# EAGLE design HitBoxV0.31-Powaa (EAGLE 9.1.3)
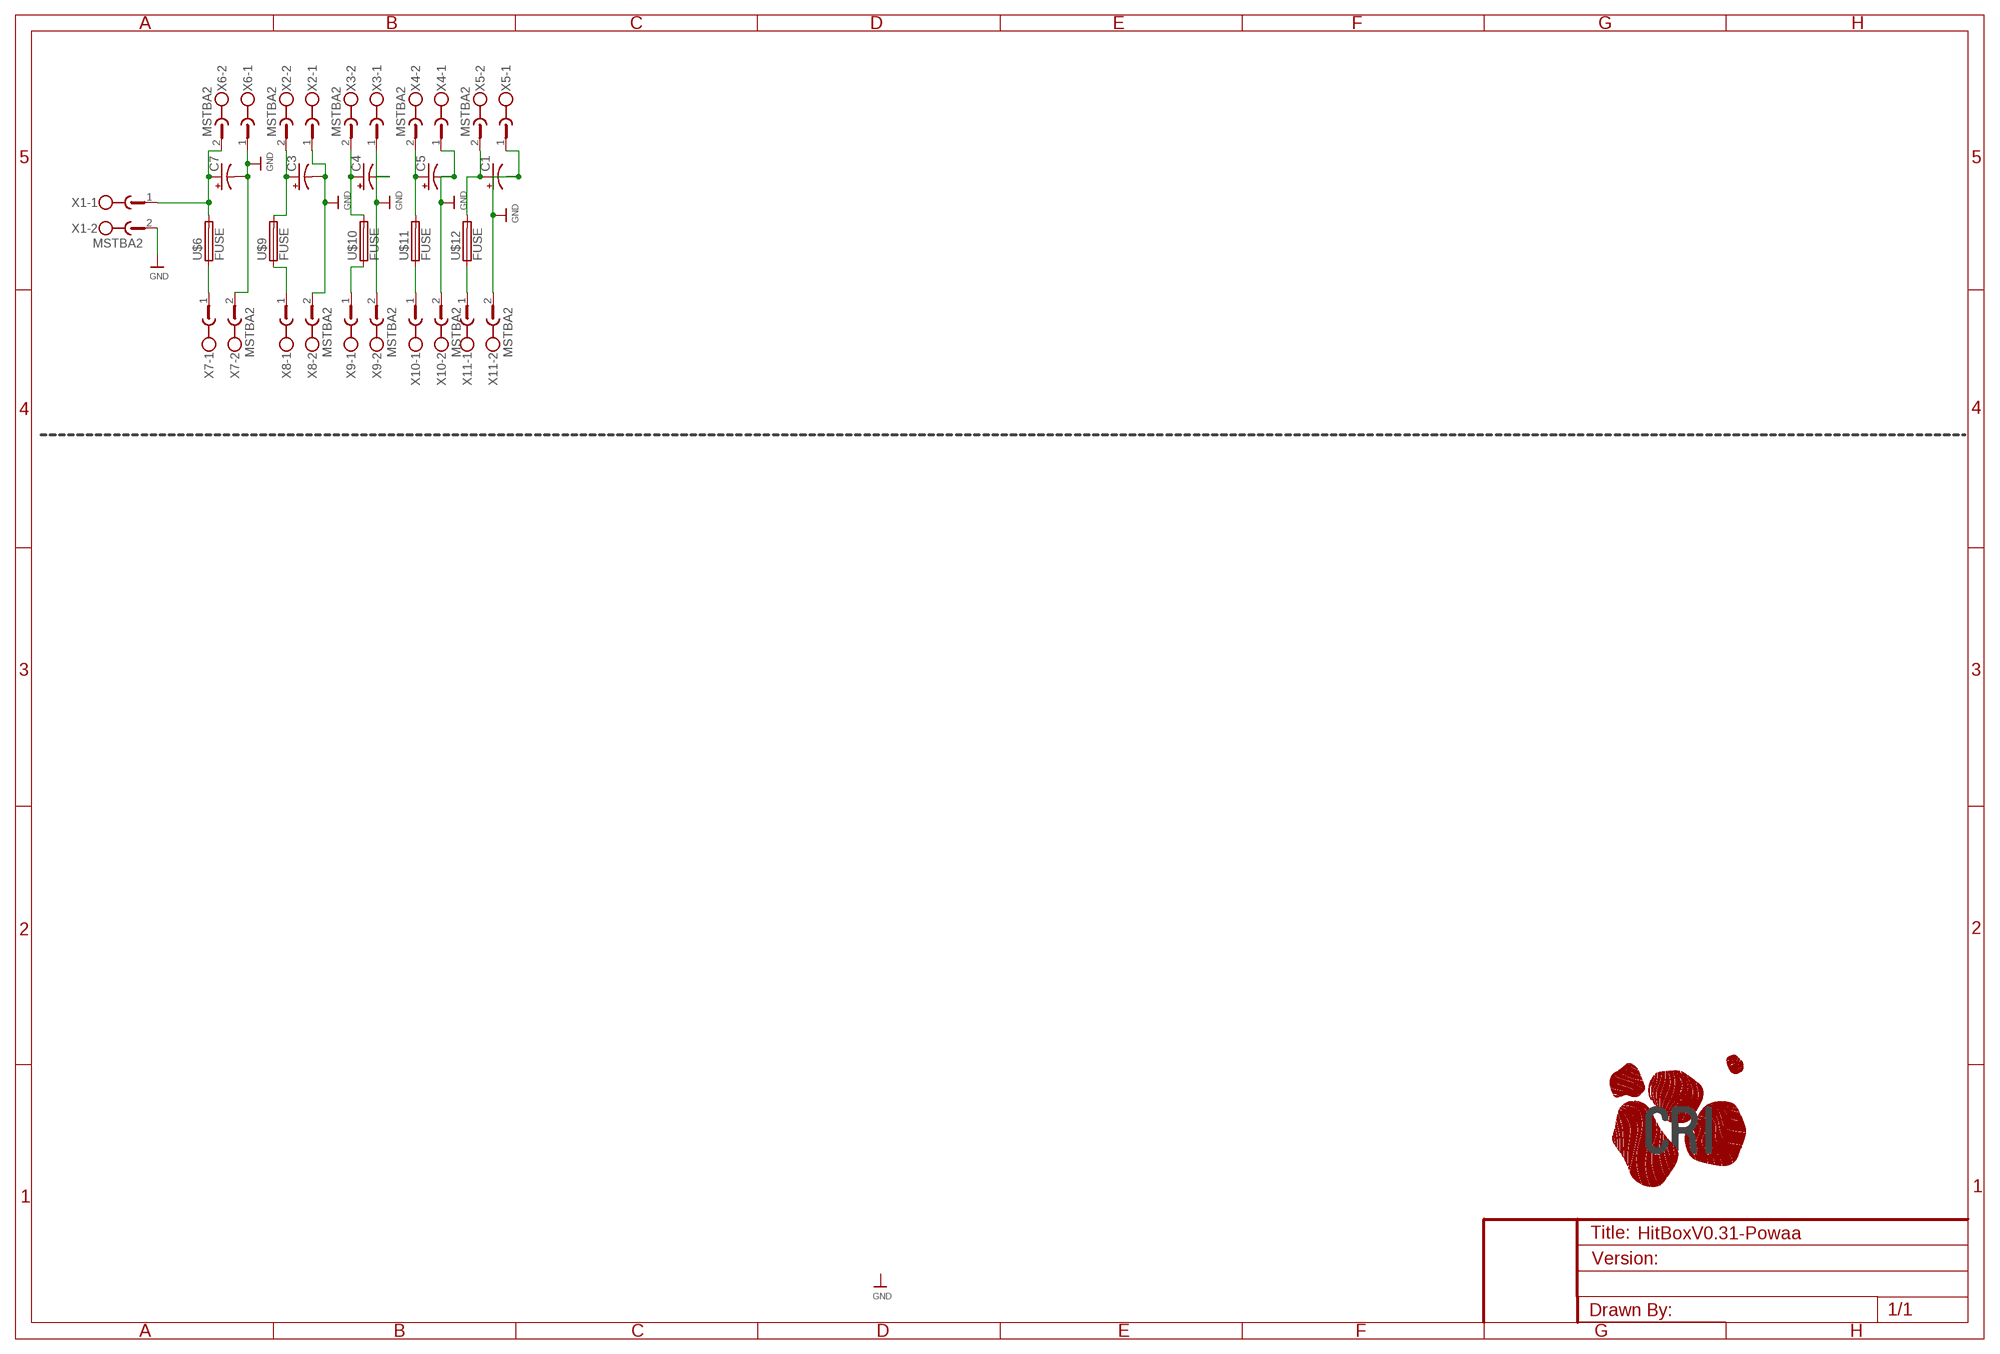
[diagram p0: schematic, sheet 1]

## Parts
C1  CPOL-USE2,5-6E  [E2,5-6E]
C3  CPOL-USE2,5-6E  [E2,5-6E]
C4  CPOL-USE2,5-6E  [E2,5-6E]
C5  CPOL-USE2,5-6E  [E2,5-6E]
C7  CPOL-USE2,5-6E  [E2,5-6E]
U$6  FUSE  [KEYSTONE-AUTO-FUSE]
U$7  LOGO-CRI-NEW-130MMX30MM-TPLACE  [LOGO_CRI-NEW-BMP30MM-TOP]
U$9  FUSE  [KEYSTONE-AUTO-FUSE]
U$10  FUSE  [KEYSTONE-AUTO-FUSE]
U$11  FUSE  [KEYSTONE-AUTO-FUSE]
U$12  FUSE  [KEYSTONE-AUTO-FUSE]
X1  MSTBA2  [MSTBA2]
X2  MSTBA2  [MSTBA2]
X3  MSTBA2  [MSTBA2]
X4  MSTBA2  [MSTBA2]
X5  MSTBA2  [MSTBA2]
X6  MSTBA2  [MSTBA2]
X7  MSTBA2  [MSTBA2]
X8  MSTBA2  [MSTBA2]
X9  MSTBA2  [MSTBA2]
X10  MSTBA2  [MSTBA2]
X11  MSTBA2  [MSTBA2]

## Nets
GND: C1.- C3.- C4.- C5.- C7.- X1.2 X2.1 X3.1 X4.1 X5.1 X6.1 X7.2 X8.2 X9.2 X10.2 X11.2
N$2: C7.+ U$6.P$3 U$6.P$4 X1.1 X6.2
N$3: C3.+ U$9.P$3 U$9.P$4 X2.2
N$6: C4.+ U$10.P$3 U$10.P$4 X3.2
N$8: C5.+ U$11.P$3 U$11.P$4 X4.2
N$10: C1.+ U$12.P$3 U$12.P$4 X5.2
N$106: U$6.P$1 U$6.P$2 X7.1
N$107: U$9.P$1 U$9.P$2 X8.1
N$108: U$10.P$1 U$10.P$2 X9.1
N$109: U$11.P$1 U$11.P$2 X10.1
N$110: U$12.P$1 U$12.P$2 X11.1

## Library data of the parts
C1 C3-C5 C7 = adafruit:CPOL-US: POLARIZED CAPACITOR, American symbol
U$6 U$9-U$12 = movuinoV0:FUSE
U$7 = movuino_aestheticsV0:LOGO-CRI-NEW-1
X1-X11 = con-phoenix-508:MSTBA2: PHOENIX; MF: FARNELL; MPN: 1757242; OC_FARNELL: 3705171; OC_NEWARK: 71C4161

## Net classes
1 pcbway_smallest: width 0.102 mm, drill 0.2 mm, clearance 0.102 mm

## Board
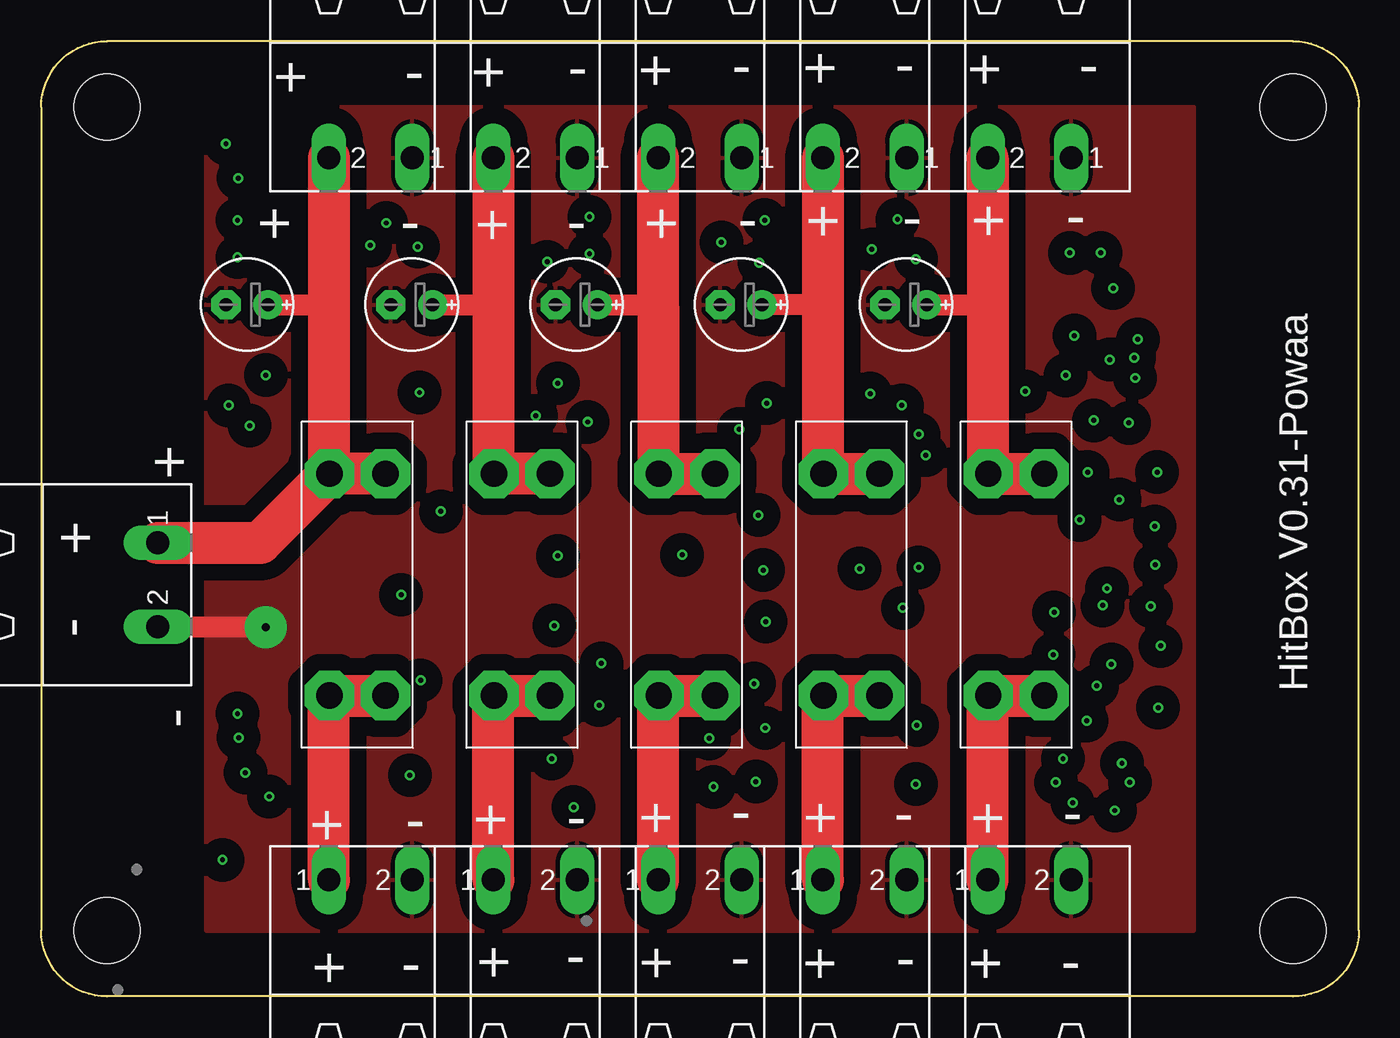
[diagram p1: board, top side]
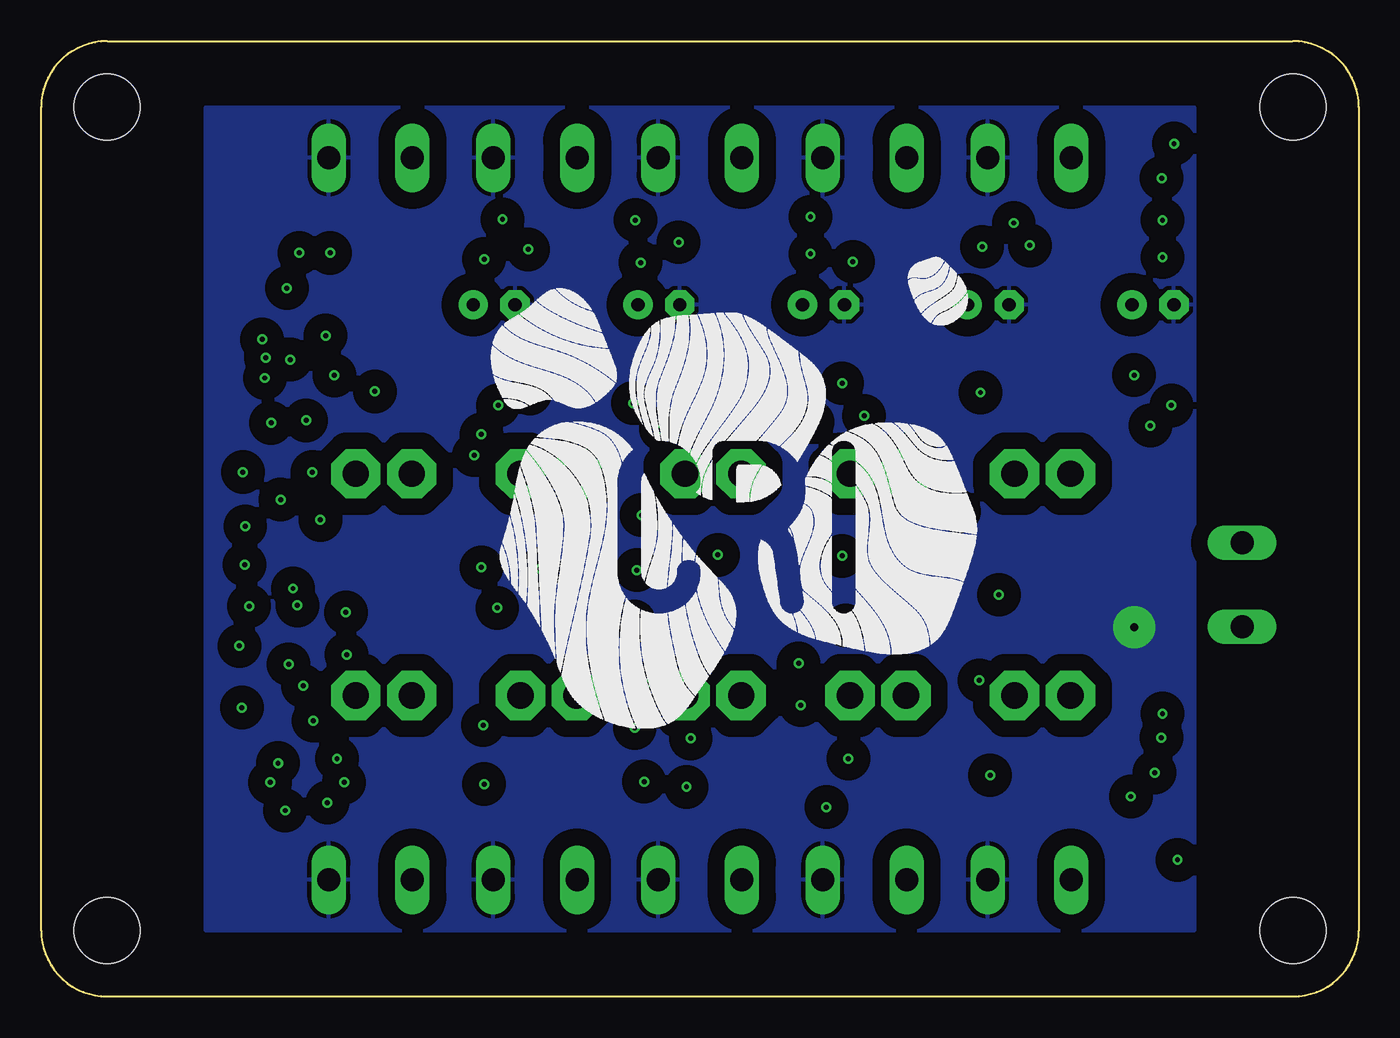
[diagram p2: board, bottom side, seen from below]

Size 80 x 58 mm. Coordinates in mm from the lower left corner, seen from the top.
Outline: 0,54 0,4 arc90 4,0 76,0 arc90 80,4 80,54 arc90 76,58 4,58 arc90 0,54
Copper layers (1*16): Top 0.035mm / dielectric 1.5mm / Bottom 0.035mm
Design rules "PCBWAY_2layer_DRU_no_angle_cheap": minimum track width 0.2mm, minimum drill 0.3mm, track to track 6mil, track to pad 6mil, pad to pad 6mil, via to via 6mil, smd to smd 0mil, copper to edge 10mil, drill to drill 10mil, minimum pad ring 10mil, minimum via ring 6mil, stop-mask expansion 2mil, vias tented up to drill 100mil, thermal gap 10mil
Holes 4 mm at 76,54 4,4 4,54 76,4

### Footprints (pad centres in the part's own frame; a part is rotated, then mirrored left to right if it is on the bottom)
E2,5-6E = drill 0.813 pad 1.778: + -1.27,0 | drill 0.813 pad 1.778 octagon: - 1.27,0
KEYSTONE-AUTO-FUSE = drill 1.6 pad 3 octagon: P$1 -6.735,1.7; P$2 -6.735,-1.7; P$3 6.735,1.7; P$4 6.735,-1.7
MSTBA2 = drill 1.397 long: 1 -2.54,5.08; 2 2.54,5.08

### Placement (x,y rotation side)
C1  52.5,42 180 top
C3  22.5,42 180 top
C4  32.5,42 180 top
C5  42.5,42 180 top
C7  12.5,42 180 top
U$6  19.2,25 90 top
U$7  36.56,28.76 0 bottom
U$9  29.2,25 90 top
U$10  39.2,25 90 top
U$11  49.2,25 90 top
U$12  59.2,25 90 top
X1  2,25 270 top
X2  30,56 180 top
X3  40,56 180 top
X4  50,56 180 top
X5  60,56 180 top
X6  20,56 180 top
X7  20,2 0 top
X8  30,2 0 top
X9  40,2 0 top
X10  50,2 0 top
X11  60,2 0 top

### Tracks (layer width: path | path; a pad name or v marks a point on that pad's centre or on a via)
GND  (via drill 0.5 pad 2.54)
  Top 1.27: X1.2 13.6,22.46 v13.64,22.42
  pour Bottom (isolate 1.016): 70,54 10,54 10,4 70,4
  pour Top (isolate 1.016): 70,54 10,54 10,4 70,4
N$2
  Top 1.27: C7.+ 16.96,42 17.46,41.5
  Top 2.54: X6.2 17.46,41.5 17.46,31.77 | 17.46,31.77 U$6.P$3 | U$6.P$4 U$6.P$3 | U$6.P$3 17.46,31.77 | X1.1 13.3,27.54 U$6.P$3
N$3
  Top 1.27: C3.+ 27.36,42 27.46,42.1
  Top 2.54: X2.2 27.46,42.1 27.46,31.77 | 27.46,31.77 U$9.P$3 | U$9.P$4 U$9.P$3 | U$9.P$3 27.46,31.77
N$4  (via drill 0.3 pad 0.6)
  other vias: 13.64,37.72
N$6
  Top 1.27: C4.+ 37.46,42 37.46,41.9
  Top 2.54: X3.2 37.46,41.9 37.46,31.77 U$10.P$3 U$10.P$4
N$7  (via drill 0.3 pad 0.6)
  other vias: 12.66,34.66
N$8
  Top 1.27: 47.46,42 C5.+
  Top 2.54: X4.2 47.46,42 47.46,31.77 U$11.P$3 U$11.P$4
N$10
  Top 1.27: C1.+ 57.26,42 57.46,42.2
  Top 2.54: X5.2 57.46,42.2 57.46,31.77 U$12.P$3 U$12.P$4
N$11  (via drill 0.3 pad 0.6)
  other vias: 11.38,35.89
N$17  (via drill 0.3 pad 0.6)
  other vias: 11.92,44.88
N$18  (via drill 0.3 pad 0.6)
  other vias: 11.92,47.13
N$19  (via drill 0.3 pad 0.6)
  other vias: 20.95,46.96
N$20  (via drill 0.3 pad 0.6)
  other vias: 22.87,45.52
N$21  (via drill 0.3 pad 0.6)
  other vias: 19.97,45.6
N$22  (via drill 0.3 pad 0.6)
  other vias: 22.97,36.67
N$23  (via drill 0.3 pad 0.6)
  other vias: 24.27,29.45
N$24  (via drill 0.3 pad 0.6)
  other vias: 21.85,24.39
N$25  (via drill 0.3 pad 0.6)
  other vias: 23.04,19.19
N$26  (via drill 0.3 pad 0.6)
  other vias: 22.39,13.43
N$27  (via drill 0.3 pad 0.6)
  other vias: 12.4,13.59
N$28  (via drill 0.3 pad 0.6)
  other vias: 11.92,17.17
N$29  (via drill 0.3 pad 0.6)
  other vias: 31.15,22.52
N$30  (via drill 0.3 pad 0.6)
  other vias: 33.87,17.68
N$31  (via drill 0.3 pad 0.6)
  other vias: 30.99,14.44
N$32  (via drill 0.3 pad 0.6)
  other vias: 32.33,11.5
N$33  (via drill 0.3 pad 0.6)
  other vias: 34.01,20.22
N$34  (via drill 0.3 pad 0.6)
  other vias: 31.37,26.75
N$35  (via drill 0.3 pad 0.6)
  other vias: 30.04,35.26
N$36  (via drill 0.3 pad 0.6)
  other vias: 33.18,34.88
N$37  (via drill 0.3 pad 0.6)
  other vias: 31.37,37.23
N$38  (via drill 0.3 pad 0.6)
  other vias: 30.72,44.61
N$39  (via drill 0.3 pad 0.6)
  other vias: 33.29,47.34
N$40  (via drill 0.3 pad 0.6)
  other vias: 33.29,45.09
N$41  (via drill 0.3 pad 0.6)
  other vias: 41.3,45.79
N$42  (via drill 0.3 pad 0.6)
  other vias: 43.92,47.13
N$43  (via drill 0.3 pad 0.6)
  other vias: 43.6,44.56
N$44  (via drill 0.3 pad 0.6)
  other vias: 42.37,34.45
N$45  (via drill 0.3 pad 0.6)
  other vias: 44.06,36.03
N$46  (via drill 0.3 pad 0.6)
  other vias: 43.55,29.23
N$47  (via drill 0.3 pad 0.6)
  other vias: 38.92,26.81
N$48  (via drill 0.3 pad 0.6)
  other vias: 43.83,25.88
N$49  (via drill 0.3 pad 0.6)
  other vias: 43.99,22.76
N$50  (via drill 0.3 pad 0.6)
  other vias: 43.28,18.99
N$51  (via drill 0.3 pad 0.6)
  other vias: 43.96,16.3
N$52  (via drill 0.3 pad 0.6)
  other vias: 40.56,15.67
N$53  (via drill 0.3 pad 0.6)
  other vias: 40.82,12.73
N$54  (via drill 0.3 pad 0.6)
  other vias: 43.39,13.05
N$55  (via drill 0.3 pad 0.6)
  other vias: 53.11,12.89
N$56  (via drill 0.3 pad 0.6)
  other vias: 53.17,16.48
N$57  (via drill 0.3 pad 0.6)
  other vias: 64.1,18.86
N$58  (via drill 0.3 pad 0.6)
  other vias: 52.31,23.59
N$59  (via drill 0.3 pad 0.6)
  other vias: 53.27,26.05
N$60  (via drill 0.3 pad 0.6)
  other vias: 49.69,25.98
N$61  (via drill 0.3 pad 0.6)
  other vias: 53.71,32.87
N$62  (via drill 0.3 pad 0.6)
  other vias: 53.27,34.13
N$63  (via drill 0.3 pad 0.6)
  other vias: 52.26,35.89
N$64  (via drill 0.3 pad 0.6)
  other vias: 50.44,45.36
N$65  (via drill 0.3 pad 0.6)
  other vias: 51.99,47.18
N$66  (via drill 0.3 pad 0.6)
  other vias: 53.11,44.77
N$67  (via drill 0.3 pad 0.6)
  other vias: 62.46,45.15
N$68  (via drill 0.3 pad 0.6)
  other vias: 64.33,45.15
N$69  (via drill 0.3 pad 0.6)
  other vias: 65.08,43.01
N$70  (via drill 0.3 pad 0.6)
  other vias: 62.73,40.12
N$71  (via drill 0.3 pad 0.6)
  other vias: 62.2,37.71
N$72  (via drill 0.3 pad 0.6)
  other vias: 63.91,34.98
N$73  (via drill 0.3 pad 0.6)
  other vias: 66.04,34.82
N$74  (via drill 0.3 pad 0.6)
  other vias: 66.42,37.55
N$75  (via drill 0.3 pad 0.6)
  other vias: 66.36,38.78
N$76  (via drill 0.3 pad 0.6)
  other vias: 66.58,39.9
N$77  (via drill 0.3 pad 0.6)
  other vias: 64.87,38.67
N$78  (via drill 0.3 pad 0.6)
  other vias: 67.75,31.83
N$79  (via drill 0.3 pad 0.6)
  other vias: 65.46,30.17
N$80  (via drill 0.3 pad 0.6)
  other vias: 50.33,36.6
N$81  (via drill 0.3 pad 0.6)
  other vias: 59.74,36.74
N$82  (via drill 0.3 pad 0.6)
  other vias: 63.53,31.83
N$83  (via drill 0.3 pad 0.6)
  other vias: 63.05,28.94
N$84  (via drill 0.3 pad 0.6)
  other vias: 61.5,23.32
N$85  (via drill 0.3 pad 0.6)
  other vias: 61.45,20.75
N$86  (via drill 0.3 pad 0.6)
  other vias: 64.44,23.75
N$87  (via drill 0.3 pad 0.6)
  other vias: 64.71,24.77
N$88  (via drill 0.3 pad 0.6)
  other vias: 64.98,20.17
N$89  (via drill 0.3 pad 0.6)
  other vias: 63.48,16.74
N$90  (via drill 0.3 pad 0.6)
  other vias: 62.04,14.44
N$91  (via drill 0.3 pad 0.6)
  other vias: 61.61,13
N$92  (via drill 0.3 pad 0.6)
  other vias: 62.62,11.77
N$93  (via drill 0.3 pad 0.6)
  other vias: 65.19,11.29
N$94  (via drill 0.3 pad 0.6)
  other vias: 66.1,13
N$95  (via drill 0.3 pad 0.6)
  other vias: 65.62,14.17
N$96  (via drill 0.3 pad 0.6)
  other vias: 67.81,17.54
N$97  (via drill 0.3 pad 0.6)
  other vias: 67.97,21.29
N$98  (via drill 0.3 pad 0.6)
  other vias: 67.38,23.7
N$99  (via drill 0.3 pad 0.6)
  other vias: 67.65,26.21
N$100  (via drill 0.3 pad 0.6)
  other vias: 67.61,28.55
N$101  (via drill 0.3 pad 0.6)
  other vias: 11.99,15.72
N$102  (via drill 0.3 pad 0.6)
  other vias: 13.84,12.14
N$103  (via drill 0.3 pad 0.6)
  other vias: 11.01,8.29
N$104  (via drill 0.3 pad 0.6)
  other vias: 11.97,49.69
N$105  (via drill 0.3 pad 0.6)
  other vias: 11.22,51.78
N$106
  Top 2.54: U$6.P$2 U$6.P$1 17.46,18.23 X7.1
N$107
  Top 2.54: X8.1 27.46,18.23 U$9.P$1 U$9.P$2
N$108
  Top 2.54: U$10.P$2 U$10.P$1 37.46,18.23 X9.1
N$109
  Top 2.54: X10.1 47.46,18.23 U$11.P$1 U$11.P$2
N$110
  Top 2.54: U$12.P$2 U$12.P$1 57.46,18.23 X11.1

### Text on the board
tNames: - | - | - | + | - | + | - | + | + | + | + | - | + | - | + | - | + | - | + | - | + | HitBox V0.31-Powaa | + | - | - | - | + | - | + | - | + | - | + | - | + | - | + | - | + | + | - | + | - | + | -
tDocu: MPU9250 | U5